# EAGLE schematic Nu8502 (EAGLE 7.7.0)

## Sheet 1 of 3: CPU
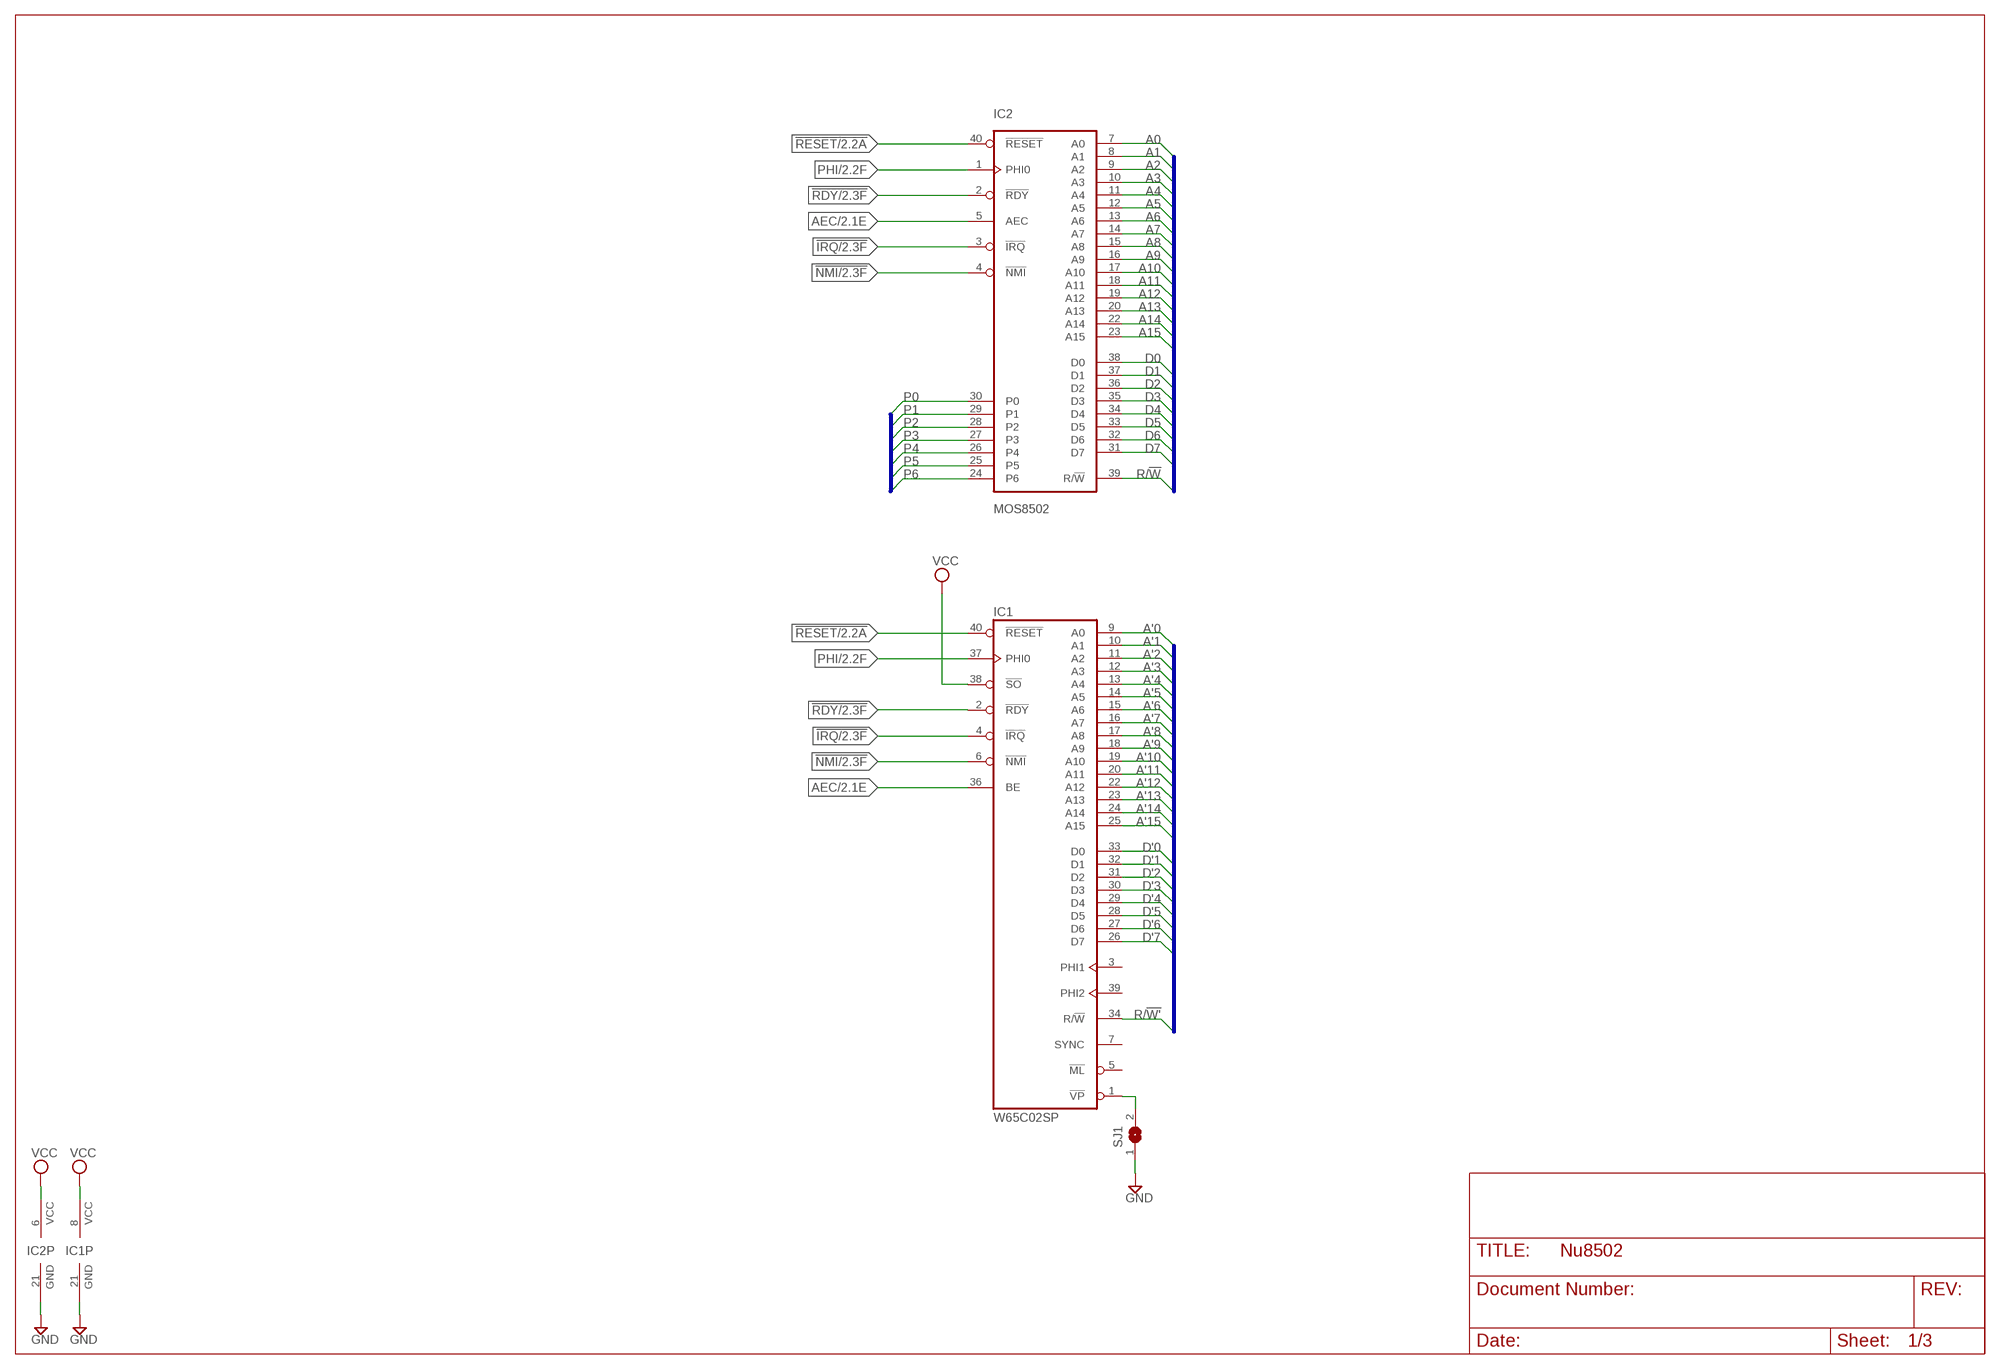
[diagram p0: schematic, sheet 1]

### Parts
IC1  W65C02SP  W65C02SP-R  [DIL40-ROUNDPAD]
IC2  MOS8502  8502-RP  [DIL40-ROUNDPAD]
SJ1  SJ  [SJ]

### Nets
!IRQ: IC1.4(!IRQ) IC2.3(!IRQ) ; also sheet 2
!NMI: IC1.6(!NMI) IC2.4(!NMI) ; also sheet 2
!RDY: IC1.2(!RDY) IC2.2(!RDY) ; also sheet 2
!RESET: IC1.40(!RESET) IC2.40(!RESET) ; also sheet 2
A0: IC2.7(A0) ; also sheet 2
A1: IC2.8(A1) ; also sheet 2
A2: IC2.9(A2) ; also sheet 2
A3: IC2.10(A3) ; also sheet 2
A4: IC2.11(A4) ; also sheet 2
A5: IC2.12(A5) ; also sheet 2
A6: IC2.13(A6) ; also sheet 2
A7: IC2.14(A7) ; also sheet 2
A8: IC2.15(A8) ; also sheet 2
A9: IC2.16(A9) ; also sheet 2
A10: IC2.17(A10) ; also sheet 2
A11: IC2.18(A11) ; also sheet 2
A12: IC2.19(A12) ; also sheet 2
A13: IC2.20(A13) ; also sheet 2
A14: IC2.22(A14) ; also sheet 2
A15: IC2.23(A15) ; also sheet 2
A'0: IC1.9(A0) ; also sheet 2
A'1: IC1.10(A1) ; also sheet 2
A'2: IC1.11(A2) ; also sheet 2
A'3: IC1.12(A3) ; also sheet 2
A'4: IC1.13(A4) ; also sheet 2
A'5: IC1.14(A5) ; also sheet 2
A'6: IC1.15(A6) ; also sheet 2
A'7: IC1.16(A7) ; also sheet 2
A'8: IC1.17(A8) ; also sheet 2
A'9: IC1.18(A9) ; also sheet 2
A'10: IC1.19(A10) ; also sheet 2
A'11: IC1.20(A11) ; also sheet 2
A'12: IC1.22(A12) ; also sheet 2
A'13: IC1.23(A13) ; also sheet 2
A'14: IC1.24(A14) ; also sheet 2
A'15: IC1.25(A15) ; also sheet 2
AEC: IC1.36(BE) IC2.5(AEC) ; also sheet 2
D0: IC2.38(D0) ; also sheet 2
D1: IC2.37(D1) ; also sheet 2
D2: IC2.36(D2) ; also sheet 2
D3: IC2.35(D3) ; also sheet 2
D4: IC2.34(D4) ; also sheet 2
D5: IC2.33(D5) ; also sheet 2
D6: IC2.32(D6) ; also sheet 2
D7: IC2.31(D7) ; also sheet 2
D'0: IC1.33(D0) ; also sheet 2
D'1: IC1.32(D1) ; also sheet 2
D'2: IC1.31(D2) ; also sheet 2
D'3: IC1.30(D3) ; also sheet 2
D'4: IC1.29(D4) ; also sheet 2
D'5: IC1.28(D5) ; also sheet 2
D'6: IC1.27(D6) ; also sheet 2
D'7: IC1.26(D7) ; also sheet 2
GND: IC1.21(GND) IC2.21(GND) SJ1.1 ; also sheet 2,3
N$1: IC1.1(!VP) SJ1.2
P0: IC2.30(P0) ; also sheet 2
P1: IC2.29(P1) ; also sheet 2
P2: IC2.28(P2) ; also sheet 2
P3: IC2.27(P3) ; also sheet 2
P4: IC2.26(P4) ; also sheet 2
P5: IC2.25(P5) ; also sheet 2
P6: IC2.24(P6) ; also sheet 2
PHI: IC1.37(PHI0) IC2.1(PHI0) ; also sheet 2
R/!W: IC2.39(R/!W) ; also sheet 2
R/!W': IC1.34(R/!W) ; also sheet 2
VCC: IC1.8(VCC) IC1.38(!SO) IC2.6(VCC) ; also sheet 3
Unconnected: IC1.3(PHI1) IC1.5(!ML) IC1.7(SYNC) IC1.39(PHI2)

### Buses
R/!W',A'[0..15],D'[0..7]
A[0..15],D[0..7],R/!W
P[0..6]

## Sheet 2 of 3: LOGIC
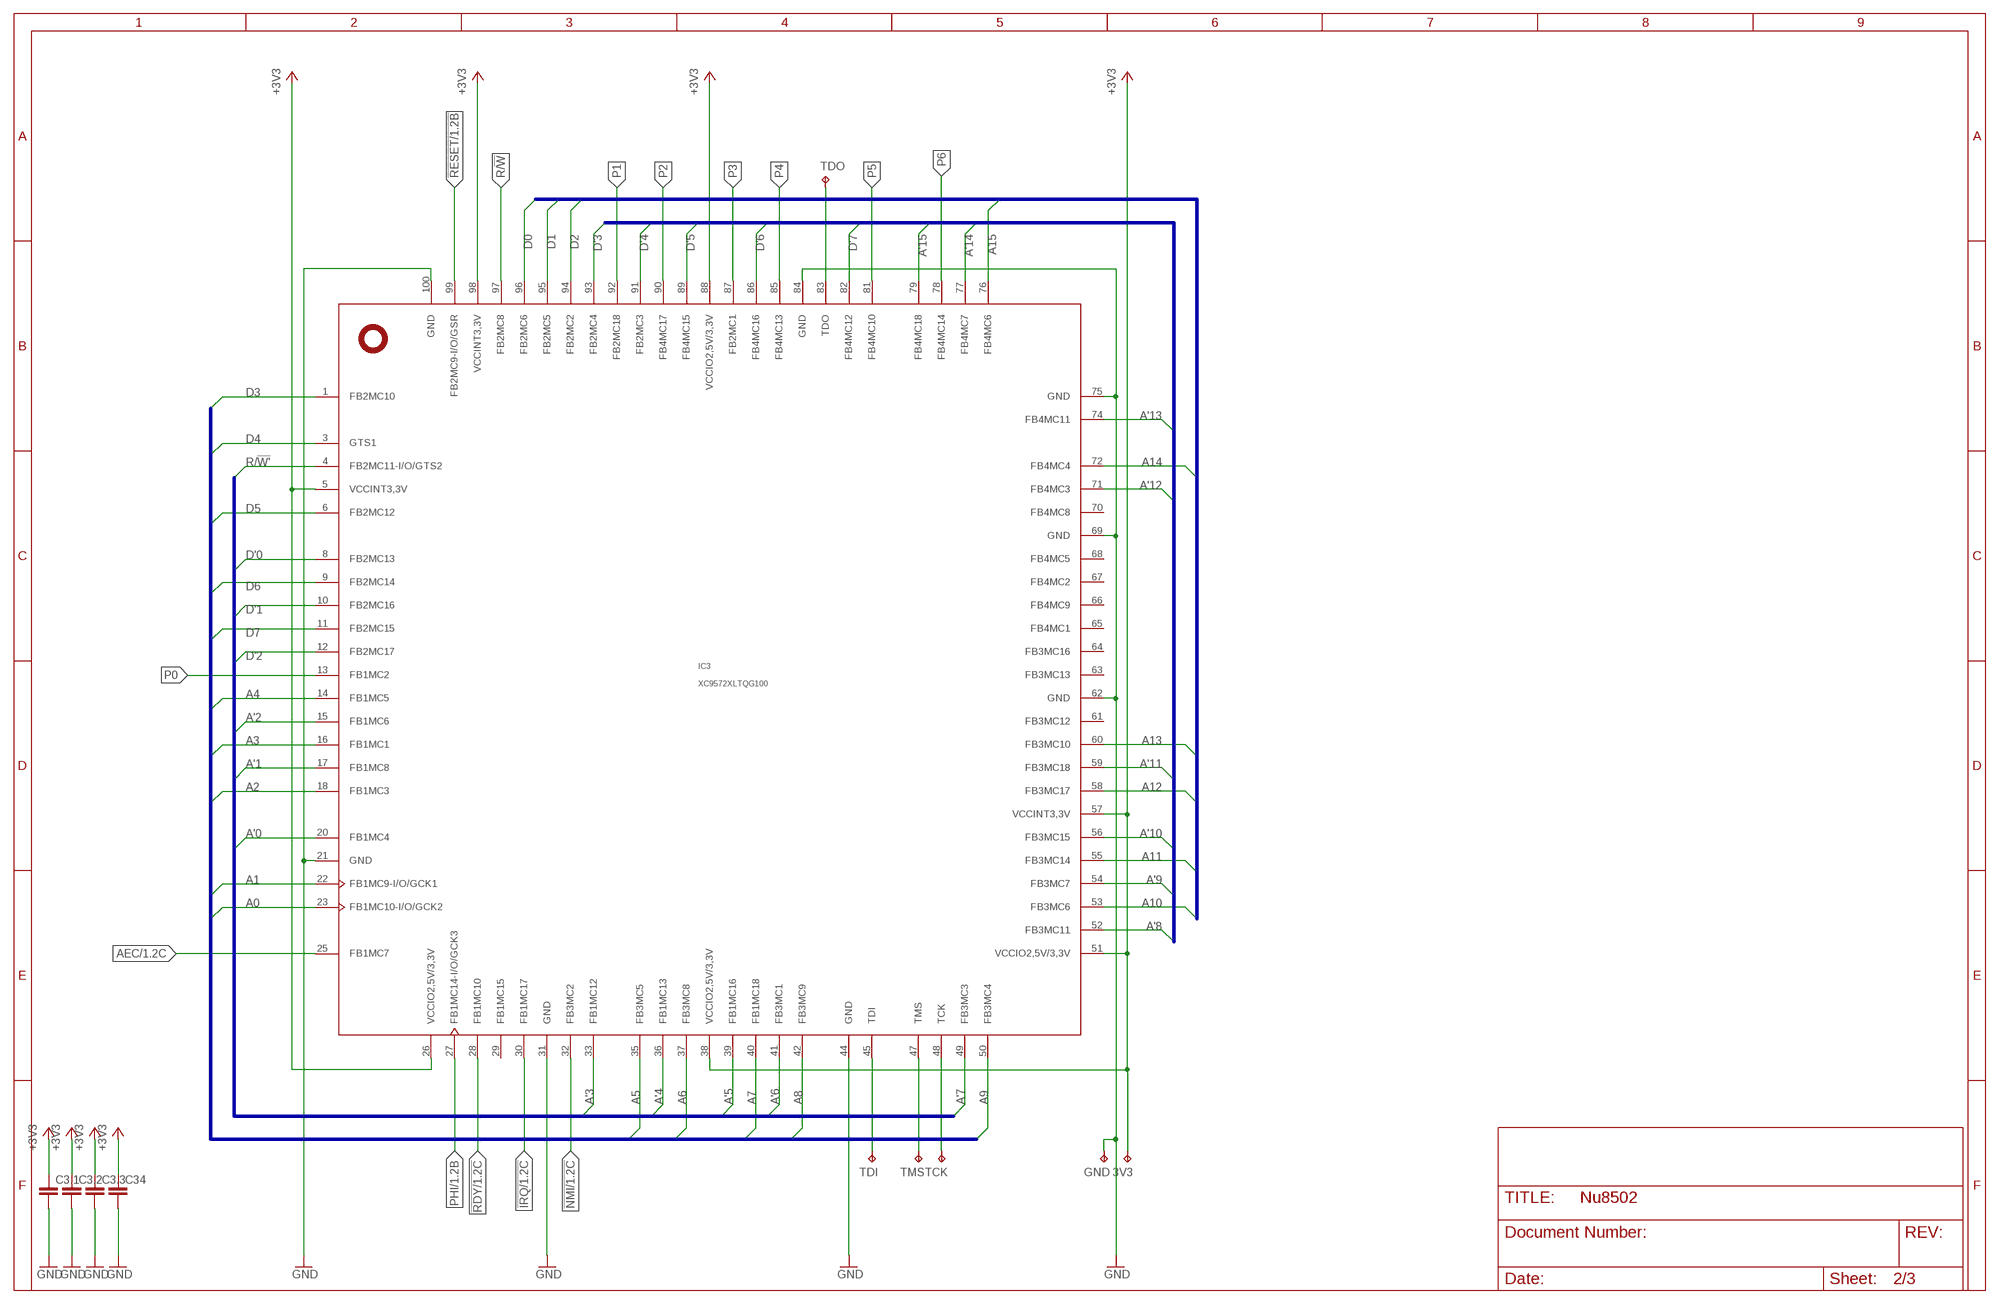
[diagram p1: schematic, sheet 2]

### Parts
3V3  TPTP10SQ  [TP10SQ]
C3.1  C-EUC0402  [C0402]
C3.2  C-EUC0402  [C0402]
C3.3  C-EUC0402  [C0402]
C34  C-EUC0402  [C0402]
GND  TPTP10SQ  [TP10SQ]
IC3  XC9572XLTQG100  [TQFP100]
TCK  TPTP10SQ  [TP10SQ]
TDI  TPTP10SQ  [TP10SQ]
TDO  TPTP10SQ  [TP10SQ]
TMS  TPTP10SQ  [TP10SQ]

### Nets
!IRQ: IC3.30(FB1MC17) ; also sheet 1
!NMI: IC3.32(FB3MC2) ; also sheet 1
!RDY: IC3.28(FB1MC10) ; also sheet 1
!RESET: IC3.99(FB2MC9-I/O/GSR) ; also sheet 1
+3V3: 3V3.TP C3.1.1 C3.2.1 C3.3.1 C34.1 IC3.5(VCCINT3,3V) IC3.26(VCCIO2,5V/3,3V) IC3.38(VCCIO2,5V/3,3V) IC3.51(VCCIO2,5V/3,3V) IC3.57(VCCINT3,3V) IC3.88(VCCIO2,5V/3,3V) IC3.98(VCCINT3,3V) ; also sheet 3
A0: IC3.23(FB1MC10-I/O/GCK2) ; also sheet 1
A1: IC3.22(FB1MC9-I/O/GCK1) ; also sheet 1
A2: IC3.18(FB1MC3) ; also sheet 1
A3: IC3.16(FB1MC1) ; also sheet 1
A4: IC3.14(FB1MC5) ; also sheet 1
A5: IC3.35(FB3MC5) ; also sheet 1
A6: IC3.37(FB3MC8) ; also sheet 1
A7: IC3.40(FB1MC18) ; also sheet 1
A8: IC3.42(FB3MC9) ; also sheet 1
A9: IC3.50(FB3MC4) ; also sheet 1
A10: IC3.53(FB3MC6) ; also sheet 1
A11: IC3.55(FB3MC14) ; also sheet 1
A12: IC3.58(FB3MC17) ; also sheet 1
A13: IC3.60(FB3MC10) ; also sheet 1
A14: IC3.72(FB4MC4) ; also sheet 1
A15: IC3.76(FB4MC6) ; also sheet 1
A'0: IC3.20(FB1MC4) ; also sheet 1
A'1: IC3.17(FB1MC8) ; also sheet 1
A'2: IC3.15(FB1MC6) ; also sheet 1
A'3: IC3.33(FB1MC12) ; also sheet 1
A'4: IC3.36(FB1MC13) ; also sheet 1
A'5: IC3.39(FB1MC16) ; also sheet 1
A'6: IC3.41(FB3MC1) ; also sheet 1
A'7: IC3.49(FB3MC3) ; also sheet 1
A'8: IC3.52(FB3MC11) ; also sheet 1
A'9: IC3.54(FB3MC7) ; also sheet 1
A'10: IC3.56(FB3MC15) ; also sheet 1
A'11: IC3.59(FB3MC18) ; also sheet 1
A'12: IC3.71(FB4MC3) ; also sheet 1
A'13: IC3.74(FB4MC11) ; also sheet 1
A'14: IC3.77(FB4MC7) ; also sheet 1
A'15: IC3.79(FB4MC18) ; also sheet 1
AEC: IC3.25(FB1MC7) ; also sheet 1
D0: IC3.96(FB2MC6) ; also sheet 1
D1: IC3.95(FB2MC5) ; also sheet 1
D2: IC3.94(FB2MC2) ; also sheet 1
D3: IC3.1(FB2MC10) ; also sheet 1
D4: IC3.3(GTS1) ; also sheet 1
D5: IC3.6(FB2MC12) ; also sheet 1
D6: IC3.9(FB2MC14) ; also sheet 1
D7: IC3.11(FB2MC15) ; also sheet 1
D'0: IC3.8(FB2MC13) ; also sheet 1
D'1: IC3.10(FB2MC16) ; also sheet 1
D'2: IC3.12(FB2MC17) ; also sheet 1
D'3: IC3.93(FB2MC4) ; also sheet 1
D'4: IC3.91(FB2MC3) ; also sheet 1
D'5: IC3.89(FB4MC15) ; also sheet 1
D'6: IC3.86(FB4MC16) ; also sheet 1
D'7: IC3.82(FB4MC12) ; also sheet 1
GND: C3.1.2 C3.2.2 C3.3.2 C34.2 GND.TP IC3.21(GND) IC3.31(GND) IC3.44(GND) IC3.62(GND) IC3.69(GND) IC3.75(GND) IC3.84(GND) IC3.100(GND) ; also sheet 1,3
N$3: IC3.48(TCK) TCK.TP
N$4: IC3.47(TMS) TMS.TP
N$5: IC3.45(TDI) TDI.TP
N$6: IC3.83(TDO) TDO.TP
P0: IC3.13(FB1MC2) ; also sheet 1
P1: IC3.92(FB2MC18) ; also sheet 1
P2: IC3.90(FB4MC17) ; also sheet 1
P3: IC3.87(FB2MC1) ; also sheet 1
P4: IC3.85(FB4MC13) ; also sheet 1
P5: IC3.81(FB4MC10) ; also sheet 1
P6: IC3.78(FB4MC14) ; also sheet 1
PHI: IC3.27(FB1MC14-I/O/GCK3) ; also sheet 1
R/!W: IC3.97(FB2MC8) ; also sheet 1
R/!W': IC3.4(FB2MC11-I/O/GTS2) ; also sheet 1
Unconnected: IC3.29(FB1MC15) IC3.61(FB3MC12) IC3.63(FB3MC13) IC3.64(FB3MC16) IC3.65(FB4MC1) IC3.66(FB4MC9) IC3.67(FB4MC2) IC3.68(FB4MC5) IC3.70(FB4MC8)

### Buses
A[0..15],D[0..7],R/!W
R/!W',A'[0..15],D'[0..7]

## Sheet 3 of 3: POWER
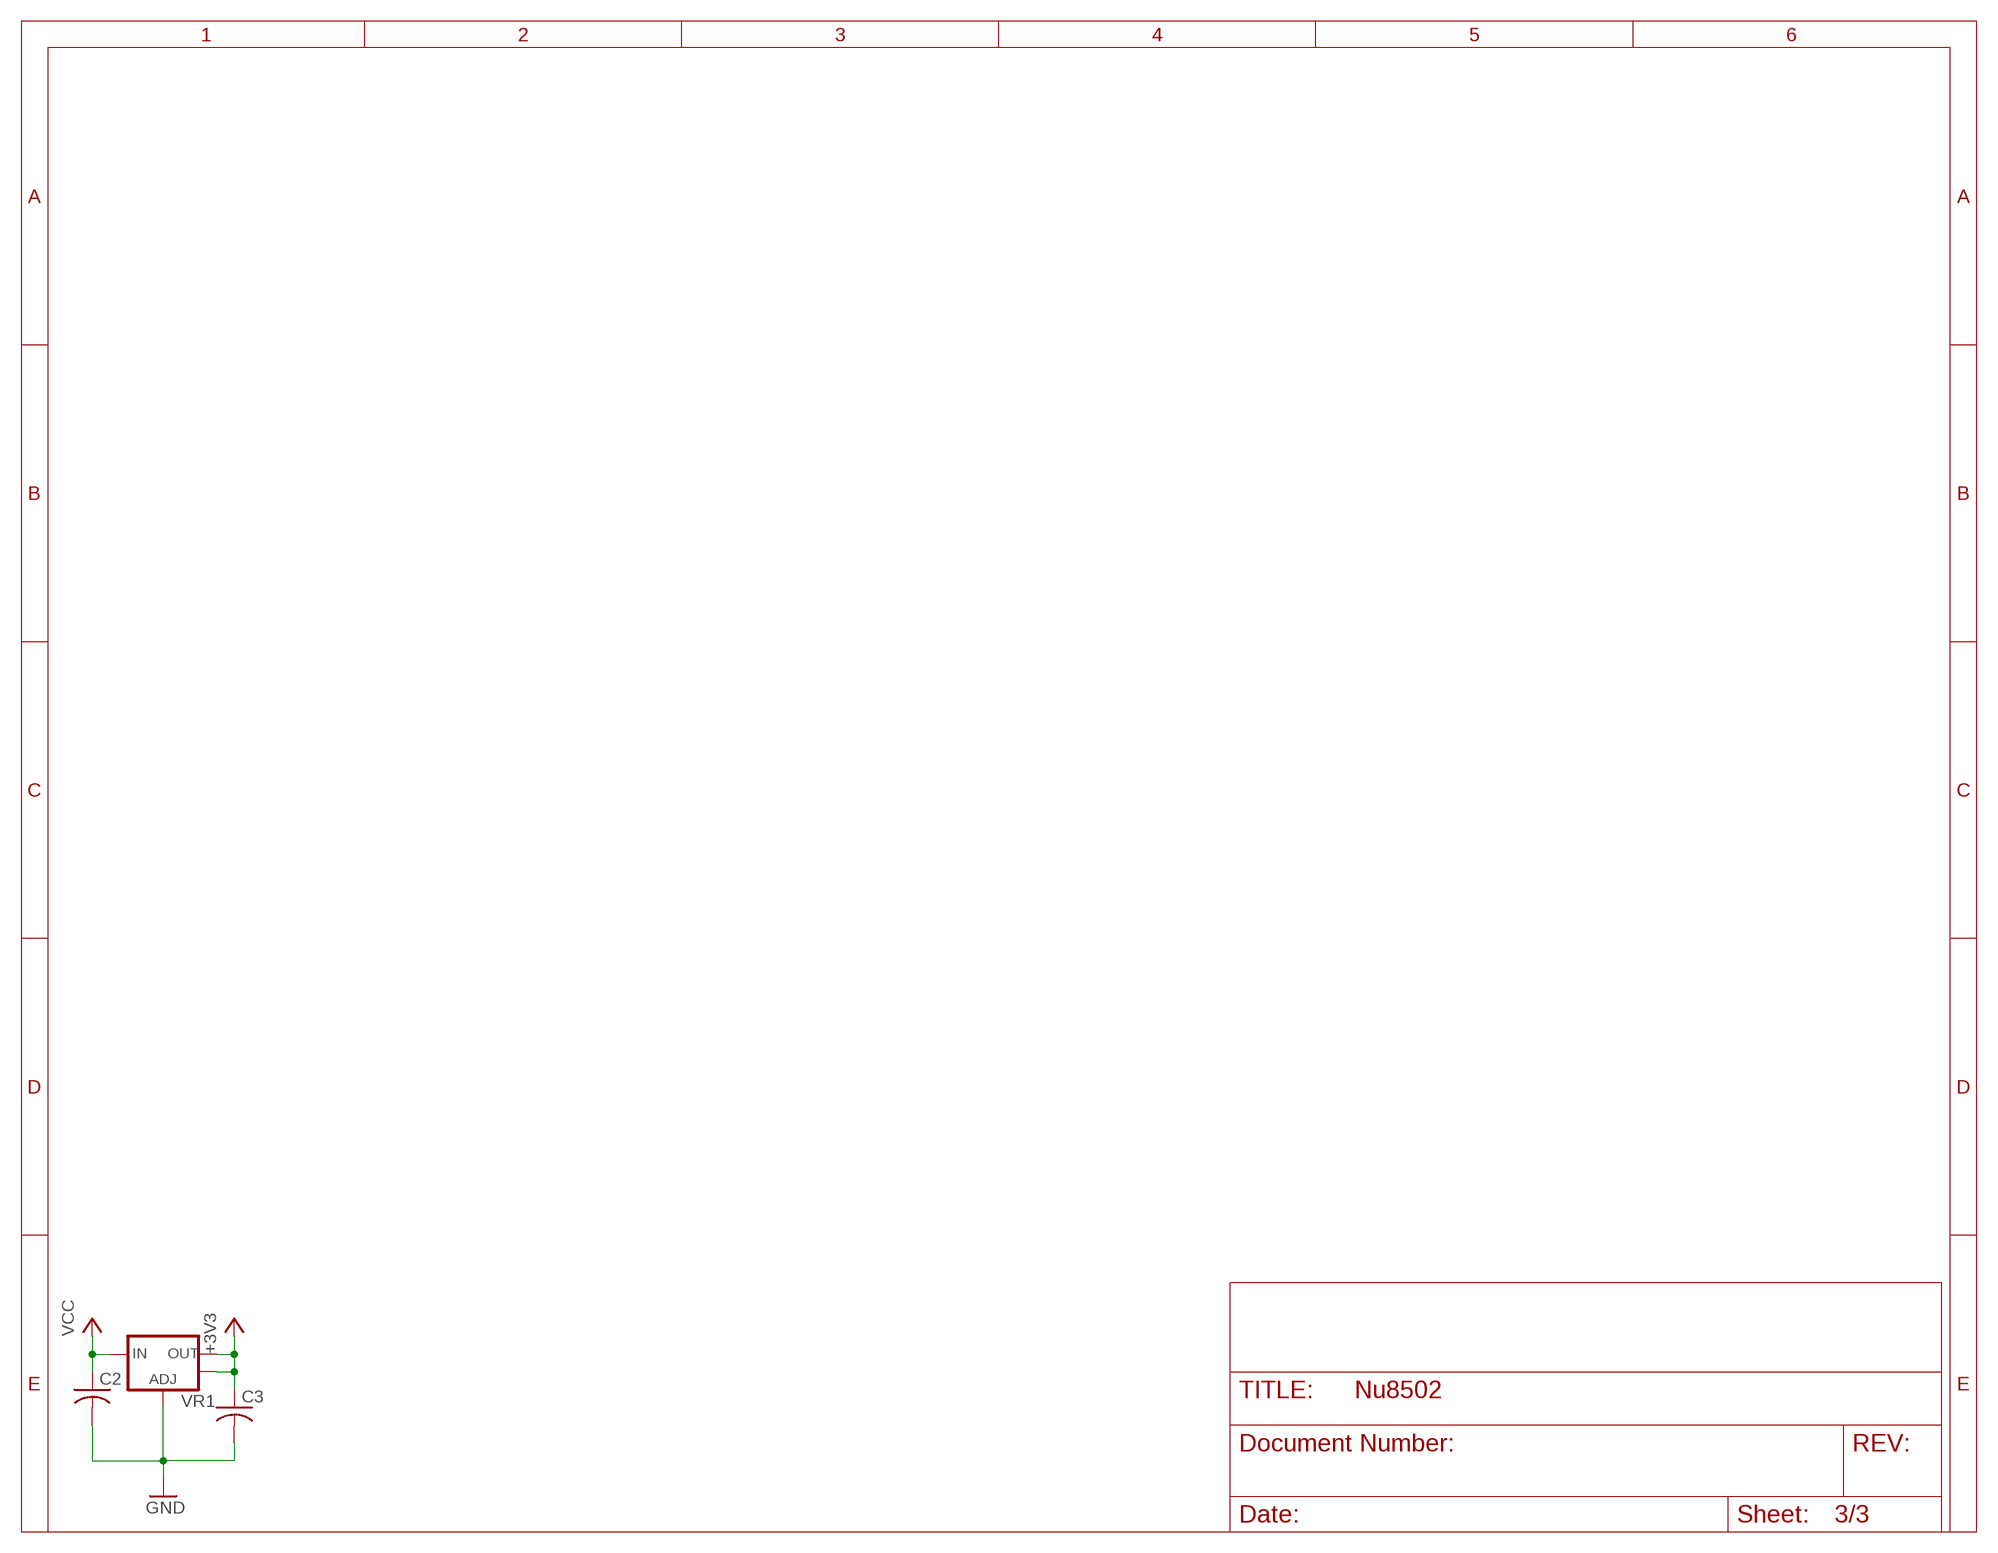
[diagram p2: schematic, sheet 3]

### Parts
C2  C-USC0805  [C0805]
C3  C-USC0805  [C0805]
VR1  V_REG_LM1117SOT223  [SOT223]

### Nets
+3V3: C3.1 VR1.2(OUT) VR1.4(OUT) ; also sheet 2
GND: C2.2 C3.2 VR1.1(ADJ) ; also sheet 1,2
VCC: C2.1 VR1.3(IN) ; also sheet 1

## Library data of the parts
3V3 GND TCK TDI TDO TMS = testpad:TP: Test pad
C2 C3 = rcl:C-US: CAPACITOR, American symbol
C3.1-C3.3 C34 = rcl:C-EU: CAPACITOR, European symbol
IC1 = commodore:W65C02SP: Western Digital Version
IC2 = commodore:8502: Processor used in Commodore 128
IC3 = xilinx_xc95XXXxl:XC9572XLTQG100
SJ1 = jumper:SJ: SMD solder JUMPER
VR1 = SparkFun:V_REG_LM1117: Voltage Regulator LM1117 Standard adjustable voltage regulator but in SMD form. Spark Fun Electronics SKU : COM-00595